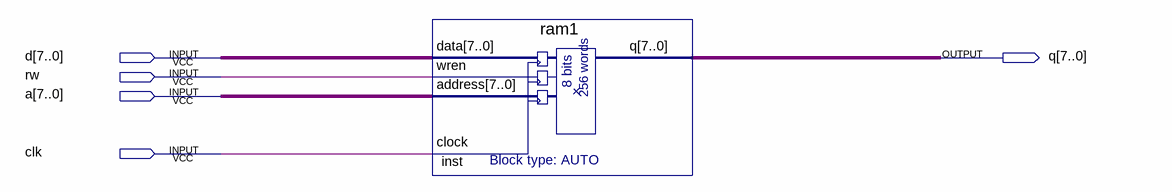
[diagram p0: schematic sheet]
// Quartus schematic 8.bdf as structural Verilog: 1 symbols, 5 pins
module \8  (
  input  [7:0] d,
  input  rw,
  input  [7:0] a,
  input  clk,
  output [7:0] q
);

  ram1 inst (.data(d), .wren(rw), .address(a), .clock(clk), .q(q));
endmodule
